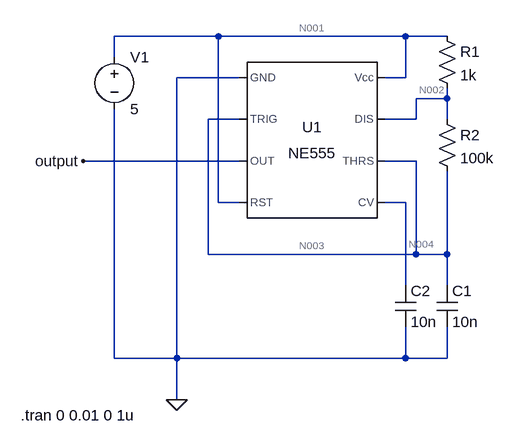
[diagram p0: schematic Draft2.asc]
Draft2.asc, the LTspice schematic file:
Version 4
SHEET 1 880 680
WIRE 48 16 -112 16
WIRE 336 16 48 16
WIRE 400 16 336 16
WIRE -112 48 -112 16
WIRE 80 80 -16 80
WIRE 336 80 336 16
WIRE 336 80 304 80
WIRE 400 112 400 96
WIRE 400 112 352 112
WIRE 80 144 32 144
WIRE 352 144 352 112
WIRE 352 144 304 144
WIRE 400 144 400 112
WIRE 80 208 -160 208
WIRE 352 208 304 208
WIRE 48 272 48 16
WIRE 80 272 48 272
WIRE 336 272 304 272
WIRE 32 352 32 144
WIRE 352 352 352 208
WIRE 352 352 32 352
WIRE 400 352 400 224
WIRE 400 352 352 352
WIRE 336 400 336 272
WIRE 400 400 400 352
WIRE -112 512 -112 128
WIRE -16 512 -16 80
WIRE -16 512 -112 512
WIRE 336 512 336 464
WIRE 336 512 -16 512
WIRE 400 512 400 464
WIRE 400 512 336 512
WIRE -16 576 -16 512
FLAG -16 576 0
FLAG -160 208 output
SYMBOL Misc\\NE555 192 176 R0
SYMATTR InstName U1
SYMBOL res 384 0 R0
SYMATTR InstName R1
SYMATTR Value 1k
SYMBOL res 384 128 R0
SYMATTR InstName R2
SYMATTR Value 100k
SYMBOL cap 384 400 R0
SYMATTR InstName C1
SYMATTR Value 10n
SYMBOL cap 320 400 R0
SYMATTR InstName C2
SYMATTR Value 10n
SYMBOL voltage -112 32 R0
WINDOW 123 0 0 Left 0
WINDOW 39 0 0 Left 0
SYMATTR InstName V1
SYMATTR Value 5
TEXT -256 600 Left 2 !.tran 0 0.01 0 1u

The netlist it stands for:
* Draft2.asc
XU1 0 N003 output N001 N004 N003 N002 N001 NE555  ; pins GND TRIG OUT RST CV THRS DIS Vcc
R1 N001 N002 1k
R2 N002 N003 100k
C1 N003 0 10n
C2 N004 0 10n
V1 N001 0 5
.tran 0 0.01 0 1u
.lib NE555.sub
.backanno
.end

* Results of the author's LTspice run, read from the files saved beside the schematic
* Operating Point, zero values left out:
*   V(n003) = 4.999 V
*   V(n004) = 3.333 V
*   V(n001) = 5 V
*   V(n002) = 5 V
*   V(output) = 5 V
*   I(R2) = 9.998 nA
*   I(R1) = 16.67 nA
*   I(V1) = -1.611 mA
*   Ix(u1:1) = -1.611 mA
*   Ix(u1:2) = 4.999 nA
*   Ix(u1:4) = 22.67 µA
*   Ix(u1:6) = 4.999 nA
*   Ix(u1:7) = 6.672 nA
*   Ix(u1:8) = 1.588 mA
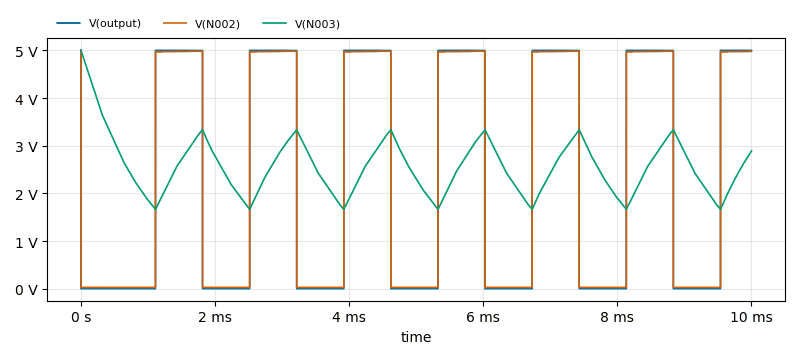
[diagram p1: Transient Analysis of Draft2.asc, plotted from the saved traces]
* Transient Analysis, 1 run:
*   V(output): min 30 µV, max 5 V, average 2.335 V, rms 3.417 V, last 5 V
*   V(N002): min 29.92 mV, max 5 V, average 2.34 V, rms 3.4 V, last 4.979 V
*   V(N003): min 1.666 V, max 4.999 V, average 2.552 V, rms 2.633 V, last 2.889 V